# Altium schematic sheet LineSensorModuleSchematic.SchDoc: EEE3061W Design Project Sensor Module
size 127 x 127 mm; DrawnBy: Team 13; DocumentNumber: 4; Revision: 0
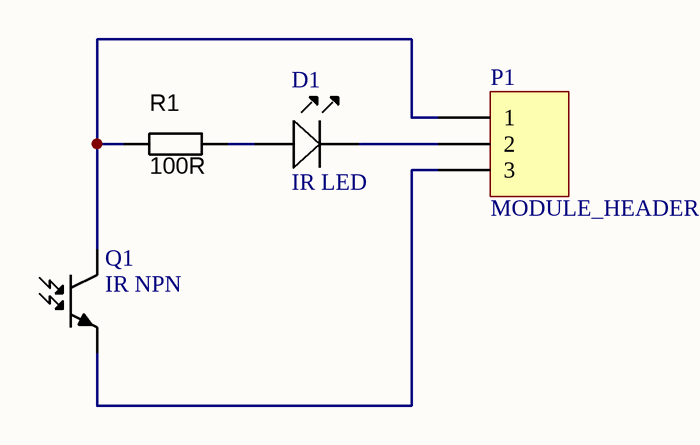
[diagram p0: LineSensorModuleSchematic.SchDoc]

## Parts
D1  IR LED  [STDLED]
P1  MODULE_HEADER  [HDR1X3]
Q1  IR NPN  [IRNPN]
R1  value 100R  [RESC3216N_ZERO]  (hidden comment: Thick Film)

## Nets
NetD1_A: D1.A R1.2
NetD1_K: D1.K P1.2
NetP1_1: P1.1 Q1.3(C) R1.1
NetP1_3: P1.3 Q1.1(E)

## Library data of the parts
D1 = IR_LED
P1 = Header 3: Header, 3-Pin; LatestRevisionDate: 17-Jul-2002; LatestRevisionNote: Re-released for DXP Platform.; Publisher: Altium Limited
Q1 = IR_NPN: pin to pad: 1>3 3>1
R1 = RES_0R_1206: Resistor SMD chip 0.0 Ohm 0.25W 1206; Manufacturer 1: Vishay/Dale; Manufacturer Part Number 1: CRCW12060000Z0EA; Tolerance: ±5%; Ratings: 1/4W; SCDType: spec*\?; Package / Case: 1206 (3216 metric); Supplier 1: Digi-Key; Supplier Part Number 1: 541-0.0ECT-ND